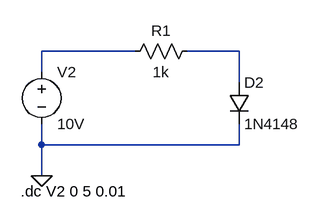
[diagram p0: schematic 1N4148 Diode DC Sweep.asc]
1N4148 Diode DC Sweep.asc, the LTspice schematic file:
Version 4.1
SHEET 1 880 680
WIRE 176 80 32 80
WIRE 336 80 256 80
WIRE 32 112 32 80
WIRE 336 128 336 80
WIRE 32 224 32 192
WIRE 336 224 336 192
WIRE 336 224 32 224
WIRE 32 272 32 224
FLAG 32 272 0
SYMBOL voltage 32 96 R0
SYMATTR InstName V2
SYMATTR Value 10V
SYMBOL res 272 64 R90
WINDOW 0 0 56 VBottom 2
WINDOW 3 32 56 VTop 2
SYMATTR InstName R1
SYMATTR Value 1k
SYMBOL diode 320 128 R0
SYMATTR InstName D2
SYMATTR Value 1N4148
TEXT 0 296 Left 2 !.dc V2 0 5 0.01

The netlist it stands for:
* 1N4148 Diode DC Sweep.asc
V2 N001 0 10V
R1 N002 N001 1k
D2 N002 0 1N4148
.model D D
.lib standard.dio
.dc V2 0 5 0.01
.backanno
.end